# EAGLE design Soic8ToDip8 (EAGLE 6.5.0)
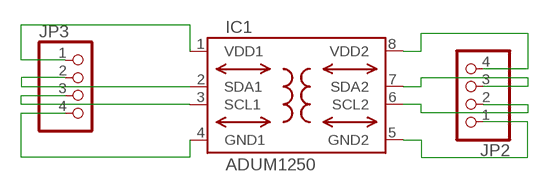
[diagram p0: schematic, sheet 1]

## Parts
IC1  ADUM1250  [SO8-COOL]
JP2  PINHD-1X4  [1X04]
JP3  PINHD-1X4  [1X04]

## Nets
GND1: IC1.4(GND1) JP3.4
GND2: IC1.5(GND2) JP2.1
N$2: IC1.3(SCL1) JP3.3
N$3: IC1.2(SDA1) JP3.2
N$4: IC1.7(SDA2) JP2.3
N$5: IC1.6(SCL2) JP2.2
VDD1: IC1.1(VDD1) JP3.1
VDD2: IC1.8(VDD2) JP2.4

## Library data of the parts
IC1 = analog-devices-3:ADUM1250: Hot Swappable, Dual I2C Isolators Source: http://www.analog.com/static/imported-files/data_sheets/ADUM1250_1251.pdf
JP2 JP3 = pinhead:PINHD-1X4: PIN HEADER

## Board
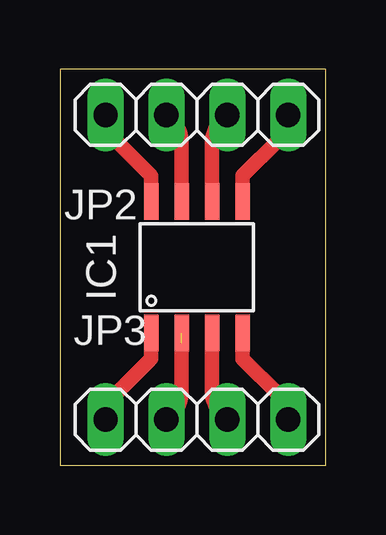
[diagram p1: board, top side]

Size 11.1 x 16.5 mm. Coordinates in mm from the lower left corner, seen from the top.
Outline: 0,0 11.1,0 11.1,16.5 0,16.5 0,0
Copper layers (1*16): Top 0.035mm / dielectric 1.5mm / Bottom 0.035mm
Design rules "default": minimum track width 10mil, minimum drill 24mil, track to track 8mil, track to pad 8mil, pad to pad 8mil, via to via 8mil, smd to smd 8mil, copper to edge 40mil, drill to drill 8mil, minimum pad ring 10mil, minimum via ring 8mil, stop-mask expansion 4mil, vias tented up to drill 0mil, thermal gap 10mil

### Footprints (pad centres in the part's own frame; a part is rotated, then mirrored left to right if it is on the bottom)
SO8-COOL = smd 0.61 x 1.524: 1 -1.905,-2.743; 2 -0.635,-2.743; 3 0.635,-2.743; 4 1.905,-2.743; 5 1.905,2.743; 6 0.635,2.743; 7 -0.635,2.743; 8 -1.905,2.743
1X04 = drill 1.016 long: 1 -3.81,0; 2 -1.27,0; 3 1.27,0; 4 3.81,0

### Placement (x,y rotation side)
IC1  5.71,8.26 0 top
JP2  5.71,14.61 180 top
JP3  5.71,1.91 0 top

### Tracks (layer width: path | path; a pad name or v marks a point on that pad's centre or on a via)
GND1
  Top 0.61: JP3.4 9.53,2.01 arc45 9.15,2.91 7.62,4.45 IC1.4
GND2
  Top 0.61: JP2.1 9.53,14.5 arc-45 9.15,13.6 7.62,12.06 IC1.5
N$2
  Top 0.61: JP3.3 6.72,2.17 arc-45 6.35,3.07 IC1.3
N$3  (1 unrouted)
  Top 0.61: JP3.2 4.71,2.17 arc45 5.08,3.07 5.08,5.08
N$4
  Top 0.61: JP2.3 4.71,14.34 arc-45 5.08,13.44 IC1.7
N$5
  Top 0.61: JP2.2 6.72,14.34 arc45 6.35,13.44 IC1.6
VDD1
  Top 0.61: JP3.1 1.91,2.01 arc-45 2.28,2.91 3.81,4.45 IC1.1
VDD2
  Top 0.61: JP2.4 1.91,14.5 arc45 2.28,13.6 3.81,12.06 IC1.8